# EAGLE schematic Schematic_v7 (EAGLE 9.7.0)
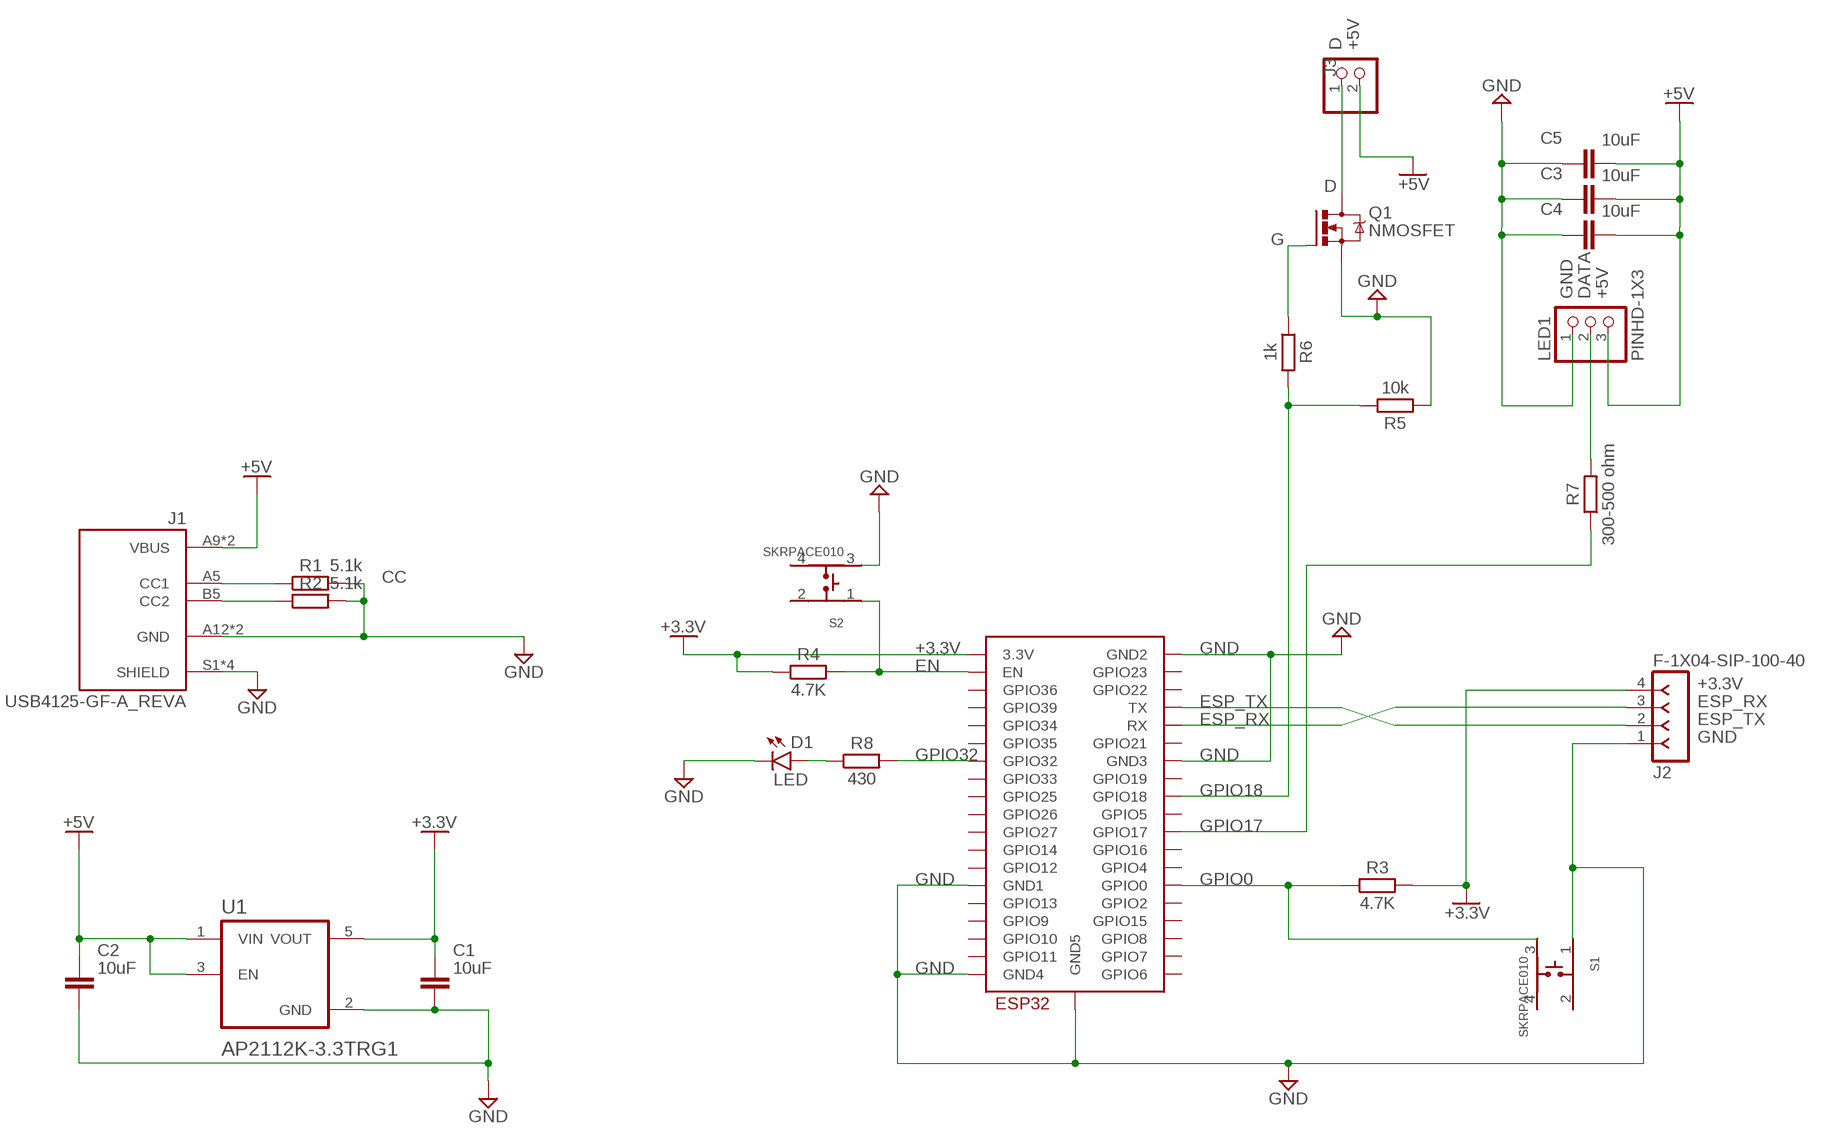
[diagram p0: schematic, sheet 1]

## Parts
C1  10uF  C_CHIP-0603(1608-METRIC)  [CAPC1608X85]
C2  10uF  C_CHIP-0603(1608-METRIC)  [CAPC1608X85]
C3  10uF  C_CHIP-0603(1608-METRIC)  [CAPC1608X85]
C4  10uF  C_CHIP-0603(1608-METRIC)  [CAPC1608X85]
C5  10uF  C_CHIP-0603(1608-METRIC)  [CAPC1608X85]
D1  LED  CHIP-FLAT-R_0603-0.80MM  [LEDC1608X80N_FLAT-R]
J1  USB4125-GF-A_REVA  [GCT_USB4125-GF-A_REVA]
J2  F-1X04-SIP-100-40  [SIP-100-04-40]
J3  PINHD-1X2  [1X02]
LED1  PINHD-1X3  [1X03]
Q1  NMOSFET  NMOSFET_SOT23  [SOT23]
R1  5.1k  R_CHIP-0603(1608-METRIC)  [RESC1608X60]
R2  5.1k  R_CHIP-0603(1608-METRIC)  [RESC1608X60]
R3  4.7K  R_CHIP-0603(1608-METRIC)  [RESC1608X60]
R4  4.7K  R_CHIP-0603(1608-METRIC)  [RESC1608X60]
R5  10k  R_CHIP-0603(1608-METRIC)  [RESC1608X60]
R6  1k  R_CHIP-0603(1608-METRIC)  [RESC1608X60]
R7  300-500 ohm  R_CHIP-0603(1608-METRIC)  [RESC1608X60]
R8  430  R_CHIP-0603(1608-METRIC)  [RESC1608X60]
S1  SKRPACE010  [SW_SKRPACE010]
S2  SKRPACE010  [SW_SKRPACE010]
U1  AP2112K-3.3TRG1  [SOT95P285X140-5N]
U2  ESP32-WROOM  [ESP32-WROOM]

## Nets
+3.3V [5V]: C1.1 J2.4 R3.2 R4.1 U1.5(VOUT) U2.3V3(3.3V)
+5V [5V]: C2.1 C3.2 C4.2 C5.2 J1.A9(VBUS) J1.B9(VBUS) J3.2 LED1.3 U1.1(VIN) U1.3(EN)
CC: J1.A5(CC1) R1.1
D [GND]: J3.1 Q1.3(D)
DATA: LED1.2 R7.2
EN: R4.2 S2.1 U2.EN
ESP_RX: J2.3 U2.RX
ESP_TX: J2.2 U2.TX
G: Q1.1(G) R6.1
GND [GND]: C1.2 C2.2 C3.1 C4.1 C5.1 D1.C J1.A12(GND) J1.B12(GND) J1.S1(SHIELD) J1.S2(SHIELD) J1.S3(SHIELD) J1.S4(SHIELD) J2.1 LED1.1 Q1.2(S) R1.2 R2.2 R5.1 S1.1 S2.3 U1.2(GND) U2.GND1 U2.GND2 U2.GND3 U2.GND4 U2.GND5
GPIO0: R3.1 S1.3 U2.IO0(GPIO0)
GPIO17: R7.1 U2.IO17(GPIO17)
GPIO18: R5.2 R6.2 U2.IO18(GPIO18)
GPIO32: R8.2 U2.IO32(GPIO32)
LED: D1.A R8.1
N$1: J1.B5(CC2) R2.1
Unconnected: S1.2 S1.4 S2.2 S2.4 U2.CLK(GPIO6) U2.CMD(GPIO11) U2.IO2(GPIO2) U2.IO4(GPIO4) U2.IO5(GPIO5) U2.IO12(GPIO12) U2.IO13(GPIO13) U2.IO14(GPIO14) U2.IO15(GPIO15) U2.IO16(GPIO16) U2.IO19(GPIO19) U2.IO21(GPIO21) U2.IO22(GPIO22) U2.IO23(GPIO23) U2.IO25(GPIO25) U2.IO26(GPIO26) U2.IO27(GPIO27) U2.IO33(GPIO33) U2.IO34(GPIO34) U2.IO35(GPIO35) U2.SD0(GPIO7) U2.SD1(GPIO8) U2.SD2(GPIO9) U2.SD3(GPIO10) U2.SENSOR_VN(GPIO39) U2.SENSOR_VP(GPIO36)

## Library data of the parts
C1-C5 = Capacitor:C: Capacitor - Generic; CATEGORY: Capacitor
D1 = LED:CHIP-FLAT-R; CATEGORY: LED; COLOR: RED; DESCRIPTION: CHIP LED FLAT; SUB-CATEGORY: CHIP; TYPE: FLAT_TOP; VALUE: LED_RED
J1 = USB4125-GF-A_REVA model:USB4125-GF-A_REVA: USB 2.0 Type C Receptacle, Horizontal, SMT, For Power charging Check prices <https://pricing.snapeda.com/parts/USB4125-GF-A/Global%20Connector%20Technology/view-part?ref=eda>; AVAILABILITY: Warning; DESCRIPTION: USB Charge Only Connector Type C Horizontal Receptacle, 3.16mm profile, 6 Pins, Surface mount, Top mount, low cost; MF: Global Connector Technology; MP: USB4125-GF-A; PACKAGE: None; PRICE: None; PURCHASE-URL: https://pricing.snapeda.com/search/part/USB4125-GF-A/?ref=eda
J2 = con-headers-jp:F-1X04-: FEMALE HEADER
J3 = Connector:PINHD-1X2: PIN HEADER; CATEGORY: CONNECTOR; SUB-CATEGORY: PIN-HEADER
LED1 = Connector:PINHD-1X3: PIN HEADER; CATEGORY: CONNECTOR; SUB-CATEGORY: PIN-HEADER
Q1 = Transistor:NMOSFET: N-Channel MOSFET - Generic; CATEGORY: Transistor; SUB-CATEGORY: MOSFET; TYPE: N-Channel
R1-R8 = Resistor:R: Resistor Fixed - Generic; CATEGORY: Resistor; SUB-CATEGORY: Fixed
S1 S2 = SKRPACE010:SKRPACE010: Switch Tactile N.O. SPST Button J-Bend 0.05A 16VDC 2.55N SMD Automotive T/R; MANUFACTURER: ALPS; STANDARD: Maniufacturer Recommendations
U1 = AP2112K-3.3TRG1:AP2112K-3.3TRG1: AP2112 Series 0.6 A 3.3 V Fixed Output SMT LDO Linear Regulator - SOT23-5; MANUFACTURER: Diodes Inc.; PARTREV: 2-2
U2 = ESP32:ESP32-WROOM

## Net classes
0 default: width 0.254 mm
1 5V: width 0.635 mm
2 GND: width 0.635 mm